# Altium project KIT_NRF52832.PrjPcb
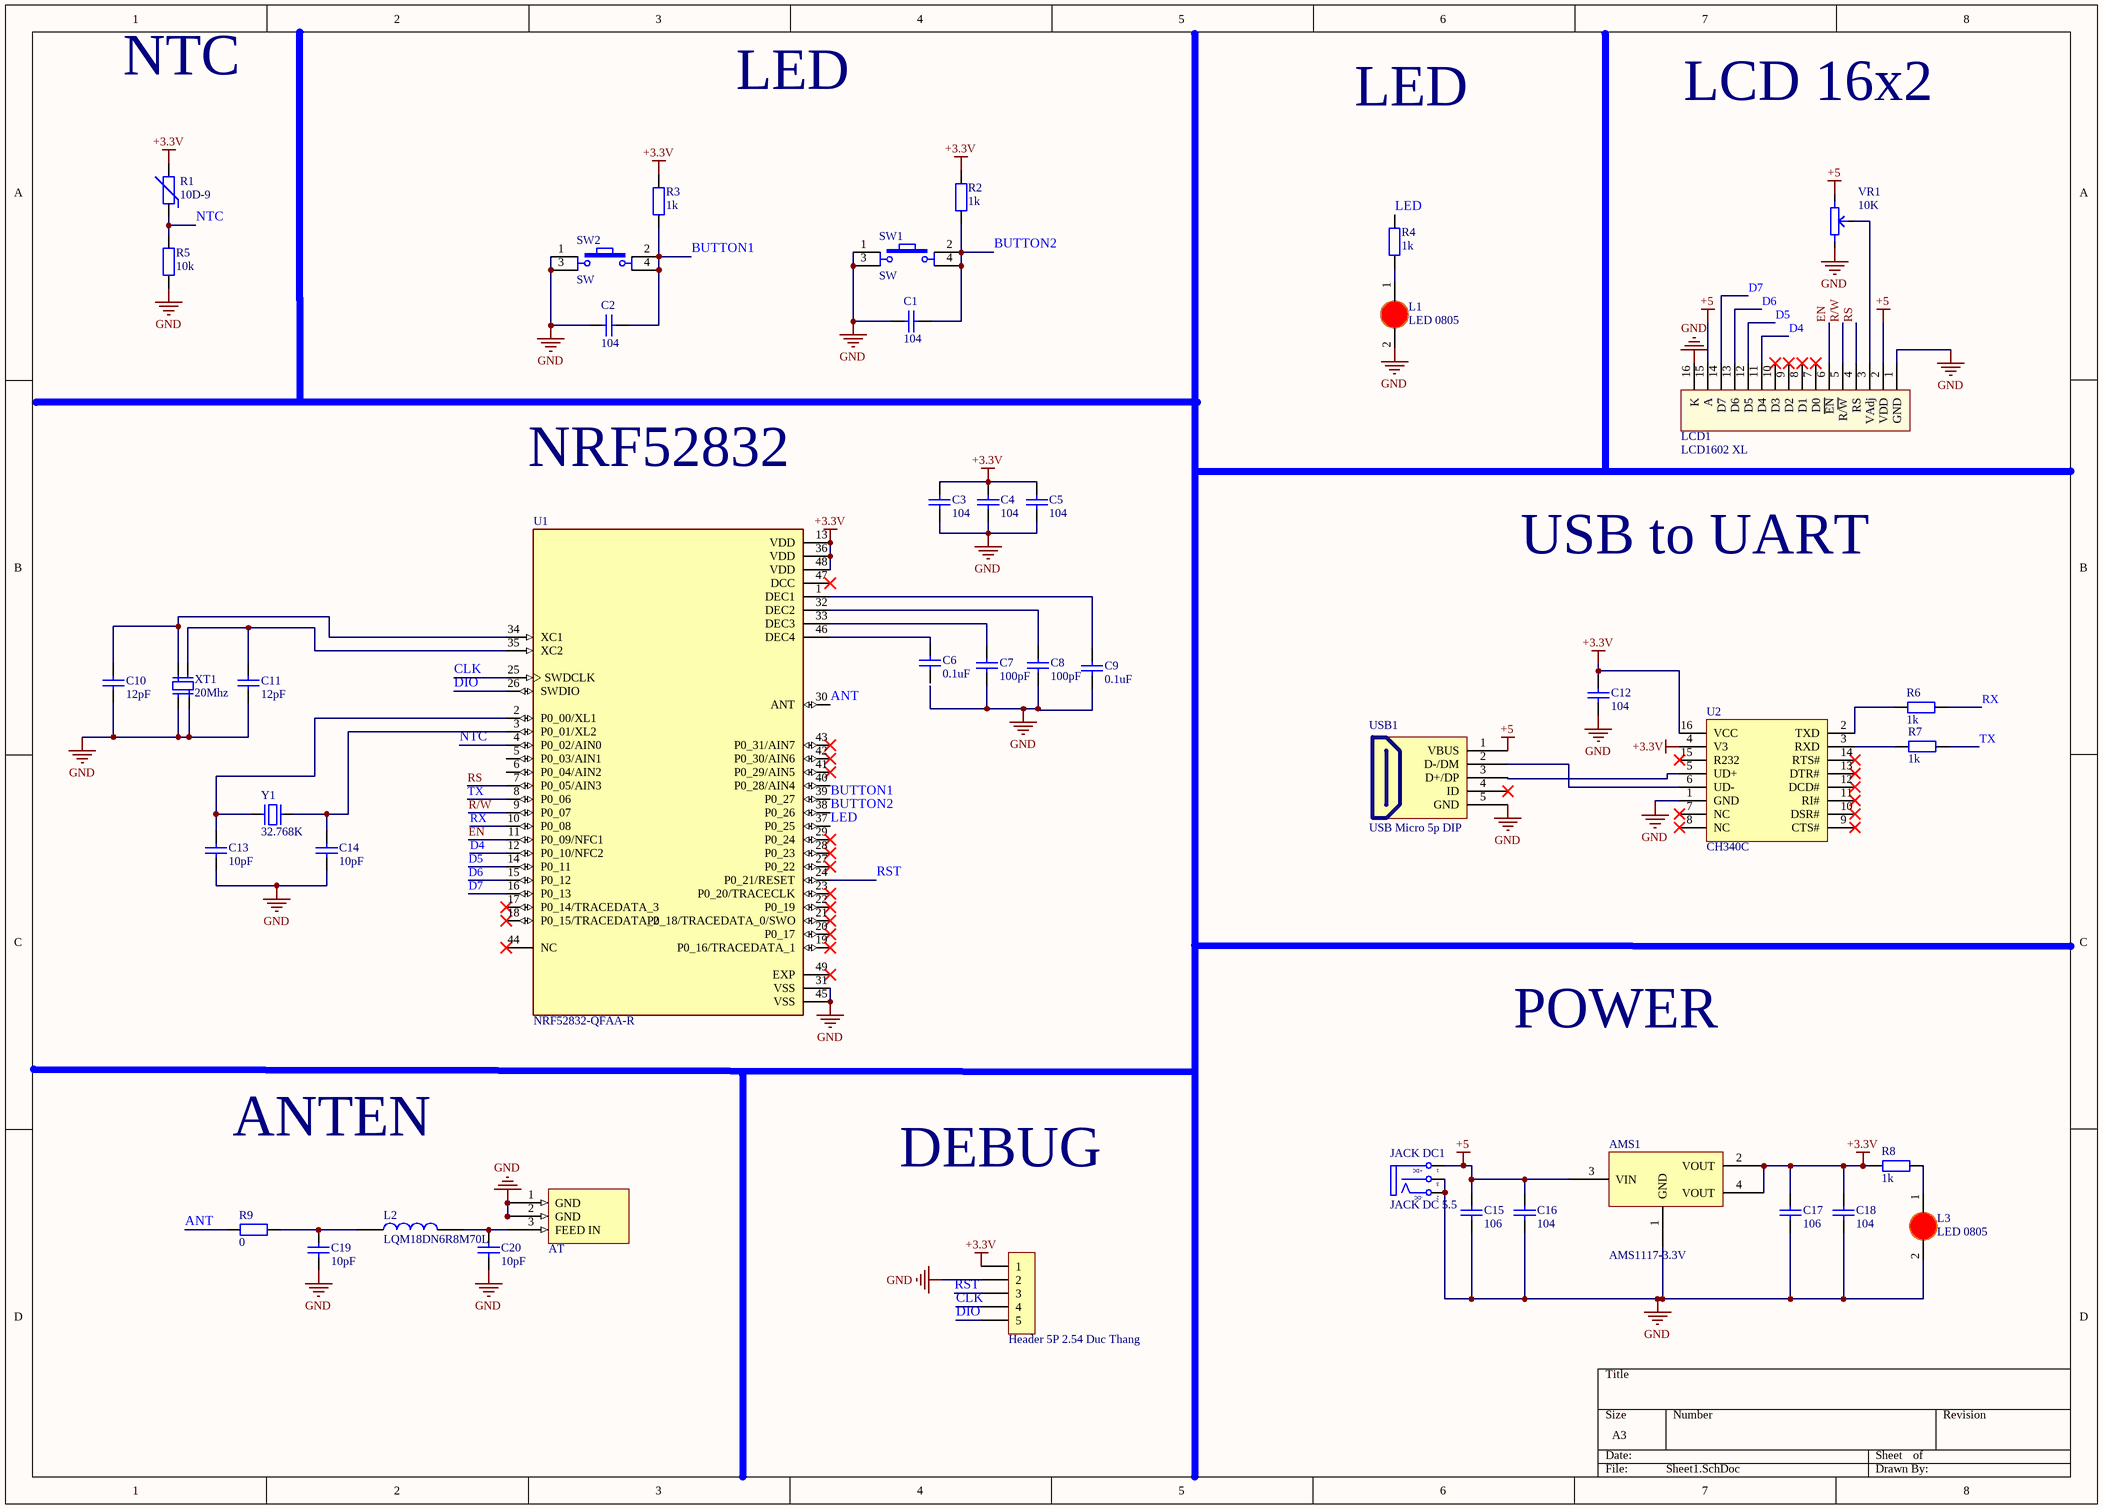
[diagram p0: Sheet1.SchDoc]
1 sheet, 45 parts. Net scope: global (net labels, ports and power ports of the same name join across sheets).
Board file: PCB1.PcbDoc

## Sheet Sheet1.SchDoc
size A3; SheetNumber: 1; SheetTotal: 1

### Parts
AMS1  AMS1117-3.3V  [SOT223]
AT  ANTEN  [Anten IFA]  (value not drawn)
C1  104  [tu 0603]
C2  104  [tu 0603]
C3  104  [tu 0603]
C4  104  [tu 0603]
C5  104  [tu 0603]
C6  0.1uF  [tu 0603]
C7  100pF  [tu 0603]
C8  100pF  [tu 0603]
C9  0.1uF  [tu 0603]
C10  12pF  [tu 0603]
C11  12pF  [tu 0603]
C12  104  [tu 0603]
C13  10pF  [tu 0603]
C14  10pF  [tu 0603]
C15  106  [tu 0603]
C16  104  [tu 0603]
C17  106  [tu 0603]
C18  104  [tu 0603]
C19  10pF  [tu 0603]
C20  10pF  [tu 0603]
H1  Header 5P 2.54 Duc Thang  [XH2.54M-5]
JACK_DC1  JACK DC 5.5  [JACK DC 5.5]
L1  LED 0805  [LED-0805-Red]
L2  LQM18DN6R8M70L  [INDC1608X95N]
L3  LED 0805  [LED-0805-Red]
LCD1  LCD1602 XL  [LCD1602 with Jump]
R1  10D-9  [tro nhiet d-9]
R2  1k  [tro smd 0603]
R3  1k  [tro smd 0603]
R4  1k  [tro smd 0603]
R5  10k  [tro smd 0603]
R6  1k  [tro smd 0603]
R7  1k  [tro smd 0603]
R8  1k  [tro smd 0603]
R9  0  [tro smd 0603]
SW1  SW  [SW4]
SW2  SW  [SW4]
U1  NRF52832-QFAA-R  [QFN40P600X600X90-49N]
U2  CH340C  [SOIC16_50_284_25X90_SMT]
USB1  USB Micro 5p DIP  [USB Micro 5p DIP]
VR1  10K  [Bien Tro Tam Giac Dung]
XT1  20Mhz  [Thach Anh 4 chan 1]
Y1  32.768K  [Thach Anh 2 chan SMD5032]

### Nets
+3.3V: AMS1.2(VOUT) AMS1.4(VOUT) C3.1 C4.1 C5.1 C12.1 C17.1 C18.1 H1.1 R1.2 R2.2 R3.2 R8.1 U1.13(VDD) U1.36(VDD) U1.48(VDD) U2.4(V3) U2.16(VCC)
+5: AMS1.3(VIN) C15.1 C16.1 JACK_DC1.1(T) LCD1.2(VDD) LCD1.15(A) USB1.1(VBUS) VR1.1
GND: AMS1.1(GND) AT.1(GND) AT.2(GND) C1.1 C2.1 C3.2 C4.2 C5.2 C7.2 C8.2 C9.2 C10.2 C11.2 C12.2 C13.2 C14.2 C15.2 C16.2 C17.2 C18.2 C19.2 C20.2 H1.2 JACK_DC1.2(TN) JACK_DC1.3(S) L1.2(K) L3.2(K) LCD1.1(GND) LCD1.16(K) R5.1 SW1.1 SW1.3 SW2.1 SW2.3 U1.31(VSS) U1.45(VSS) U2.1(GND) USB1.5(GND) VR1.3 XT1.1 XT1.3
ANT: R9.1 U1.30(ANT)
BUTTON1: C2.2 R3.1 SW2.2 SW2.4 U1.39(P0_27)
BUTTON2: C1.2 R2.1 SW1.2 SW1.4 U1.38(P0_26)
CLK: H1.4 U1.25(SWDCLK)
D4: LCD1.11(D4) U1.12(P0_10/NFC2)
D5: LCD1.12(D5) U1.14(P0_11)
D6: LCD1.13(D6) U1.15(P0_12)
D7: LCD1.14(D7) U1.16(P0_13)
DIO: H1.5 U1.26(SWDIO)
EN: LCD1.6(~{EN}) U1.11(P0_09/NFC1)
LED: R4.2 U1.37(P0_25)
NTC: R1.1 R5.2 U1.4(P0_02/AIN0)
R/W: LCD1.5(R/~{W}) U1.9(P0_07)
RS: LCD1.4(RS) U1.7(P0_05/AIN3)
RST: H1.3 U1.24(P0_21/RESET)
RX: R6.2 U1.10(P0_08)
TX: R7.2 U1.8(P0_06)
NetAT_3: AT.3(FEED_IN) C20.1 L2.2
NetC6_1: C6.1 U1.46(DEC4)
NetC7_1: C7.1 U1.33(DEC3)
NetC8_1: C8.1 U1.32(DEC2)
NetC9_1: C9.1 U1.1(DEC1)
NetC10_1: C10.1 U1.34(XC1) XT1.2
NetC11_1: C11.1 U1.35(XC2) XT1.4
NetC13_1: C13.1 U1.2(P0_00/XL1) Y1.1
NetC14_1: C14.1 U1.3(P0_01/XL2) Y1.2
NetC19_1: C19.1 L2.1 R9.2
NetL1_1: L1.1(A) R4.1
NetL3_1: L3.1(A) R8.2
NetLCD1_3: LCD1.3(VAdj) VR1.2
NetR6_1: R6.1 U2.2(TXD)
NetR7_1: R7.1 U2.3(RXD)
NetU2_5: U2.5(UD+) USB1.3(D+/DP)
NetU2_6: U2.6(UD-) USB1.2(D-/DM)

Not connected (* = marked no-connect by the designer): C6 2; LCD1 7(D0)* 8(D1)* 9(D2)* 10(D3)*; U1 5(P0_03/AIN1) 6(P0_04/AIN2) 17(P0_14/TRACEDATA_3)* 18(P0_15/TRACEDATA_2)* 19(P0_16/TRACEDATA_1)* 20(P0_17)* 21(P0_18/TRACEDATA_0/SWO)* 22(P0_19)* 23(P0_20/TRACECLK)* 27(P0_22)* 28(P0_23)* 29(P0_24)* 40(P0_28/AIN4) 41(P0_29/AIN5)* 42(P0_30/AIN6)* 43(P0_31/AIN7)* 44(NC)* 47(DCC)* 49(EXP)*; U2 7(NC)* 8(NC)* 9(CTS#)* 10(DSR#)* 11(RI#)* 12(DCD#)* 13(DTR#)* 14(RTS#)* 15(R232)*; USB1 4(ID)*

### Notes on the sheet
- NTC
- LED
- LCD 16x2
- NRF52832
- USB to UART
- POWER
- ANTEN
- DEBUG
- (in symbol JACK DC 5.5) +DC; -DC

### Library data of the parts
AMS1 = AMS1117 SMD: Dán; Value: AMS1117-3.3V SOT223; Don_Vi: Con; Ma_Hang: MH000596; Ghi_Chu: *; Kieu_Chan: *; Chung_Loai: Dán
AT = ANTEN: Anten IFA- BLE RANGDONG
C1-C11 C13 C14 C19 C20 = Tu 0603 102 50V 10%: Dán; Don_Vi: Con; So_Chan: 2; Ten_Linh_Kien: Tụ 0603 102-1nF 10% 50V; Ma_Hang: MH004566; Chung_Loai: Dán; Kieu_Chan: *
C12 C16 C18 = Tu 0603 104 50V 10%: Dán; Don_Vi: Con; So_Chan: 2; Ten_Linh_Kien: Tụ 0603 104-100nF 10% 50V; Ma_Hang: MH004568; Chung_Loai: Dán; Kieu_Chan: *
C15 C17 = Tu 0603 106 16V 20%: Dán; Don_Vi: Con; So_Chan: 2; Ten_Linh_Kien: Tụ 0603-10uF 20% 16V; Ma_Hang: MH004848; Chung_Loai: Dán; Kieu_Chan: *
H1 = Header 5P 2.54 Duc Thang: Cắm; Ten_Linh_Kien: Header 5P XH2.54-5P Đực Thẳng; Don_Vi: Con; Ma_Hang: MH001298; Chung_Loai: Cắm
JACK_DC1 = JACK DC 5.5: Value: Jac DC
L1 L3 = LED 0805 Do: Dán; Don_Vi: Con; Ma_Hang: MH000897; Ten_Linh_Kien: LED 0805 Màu Đỏ (Red); Ghi_Chu: *; Kieu_Chan: *; Chung_Loai: Dán
L2 = LQM18DN6R8M70L: Inductor with Inductance 6.8uH Tol.+/-20% Package 0603 (1608); MF: Murata Electronics; Availability: Warning; Price: None; Package: 0603 Murata; MP: LQM18DN6R8M70L; Value: *; SnapEDA_Link: https://www.snapeda.com/parts/LQM18DN6R8M70L/Murata/view-part/4901183/?ref=snap; Check_prices: https://www.snapeda.com/parts/LQM18DN6R8M70L/Murata/view-part/4901183/?ref=eda; Purchase-URL: https://pricing.snapeda.com/search/part/LQM18DN6R8M70L/?ref=eda
LCD1 = LCD1602 XL: LCD 1602 Xanh Lá; Ten: Màn hình LCD 1602 Xanh Lá; Ma_Hang: 67HZ; NCC: NSHOP; CHIP: HD44780
R1 = Tro Nhiet NTC 10D-9: Cắm; So_Chan: 2; Don_Vi: Con; Ten_Linh_Kien: Điện trở nhiệt NTC 10D-9; Ma_Hang: MH000922; Chung_Loai: Cắm; Kieu_Chan: *
R2-R9 = Tro 0603 1% 1k: Dán; So_Chan: 2; Don_Vi: Con; Ten_Linh_Kien: Trở 0603 1% 1k; Ma_Hang: MH006334; Chung_Loai: Dán; Kieu_Chan: *
SW1 SW2 = SW4: Switch button 4 pin; Value: Button chip 4 pin
U1 = NRF52832-QFAA-R: IC RF TxRx + MCU Bluetooth, General ISM > 1GHz ANT, Bluetooth v5.0 2.4GHz 48-VFQFN Exposed Pad; MF: Nordic; SnapEDA_Link: https://www.snapeda.com/parts/NRF52832-QFAA-R/Nordic+Semiconductor+ASA/view-part/?ref=snap; Package: VFQFN-48 Nordic Semiconductor; Value: *; MP: NRF52832-QFAA-R; Check_prices: https://www.snapeda.com/parts/NRF52832-QFAA-R/Nordic+Semiconductor+ASA/view-part/?ref=eda
U2 = CH340C: USB Bridge, USB to UART USB 2.0 UART Interface; Manufacturer: Olimex; Alternate Part Number-1: NA; Manufacturer Part Number: CH340C; Case/Package: SOIC16; Supplier-1: LCSC; Supplier Part Number-1: C84681
USB1 = USB Micro 5p DIP: USB Type B; Ten: MicroUSB MK5P DIP; Ma_Hang: MH005145
VR1 = Bien tro tam giac 10K Dung: Cắm; Ma_Hang: MH000919; Don_Vi: Con; Ten_Linh_Kien: Biến Trở Tam Giác 103-10K RM065 (Chân Đứng); Chung_Loai: Cắm; Kieu_Chan: *
XT1 = Thach Anh 4 Chan SMD: Crystal For all Crystal 2pin.; Value: 4Mhz
Y1 = Thach Anh 2 chan SMD 5032: Crystal For all Crystal 2pin.; Value: 4Mhz